# EAGLE design attiny_project (EAGLE 6.6.0)
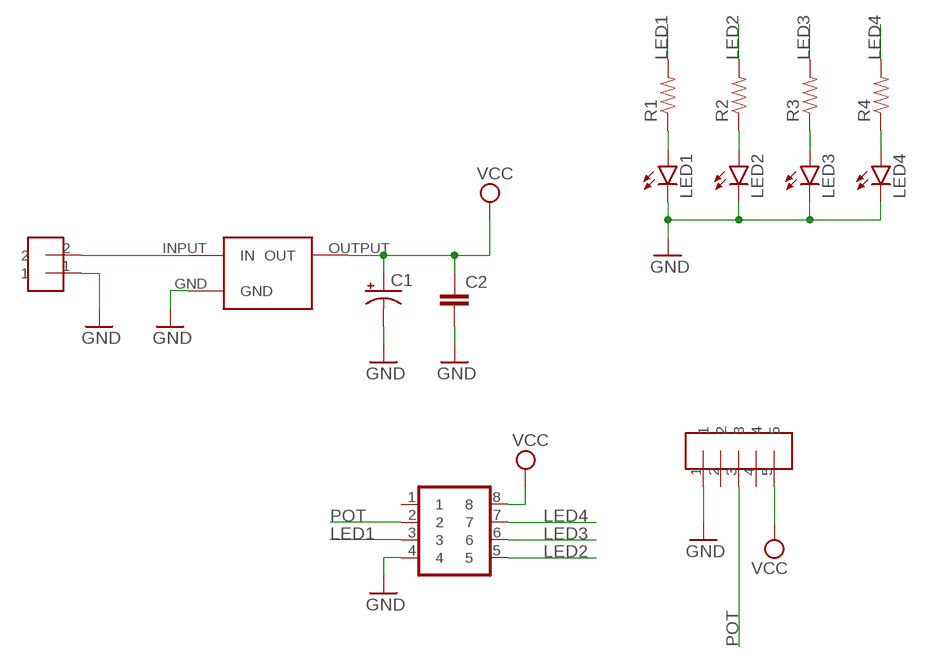
[diagram p0: schematic, sheet 1]

## Parts
C1  CAP_POLPTH2  [CPOL-RADIAL-10UF-25V]
C2  CAPPTH  [CAP-PTH-SMALL]
LED1  LED5MM  [LED5MM]
LED2  LED5MM  [LED5MM]
LED3  LED5MM  [LED5MM]
LED4  LED5MM  [LED5MM]
R1  RESISTORPTH-1/4W  [AXIAL-0.4]
R2  RESISTORPTH-1/4W  [AXIAL-0.4]
R3  RESISTORPTH-1/4W  [AXIAL-0.4]
R4  RESISTORPTH-1/4W  [AXIAL-0.4]
U$1  SOCKET-8PINDIP  [SOCKET-8PIN]
U$2  HEADER-5  [HEADER-5]
U$3  REGULATOR5V-MC7805CT  [REGULATOR-7805]
U$4  HEADER-2  [HEADER-2]

## Nets
GND: C1.2(-) C2.2 LED1.K(C) LED2.K(C) LED3.K(C) LED4.K(C) U$1.4 U$2.1 U$3.GND U$4.1
LED1: R1.P$2 U$1.3
LED2: R2.P$2 U$1.5
LED3: R3.P$2 U$1.6
LED4: R4.P$2 U$1.7
N$1: U$3.INPUT(IN) U$4.2
N$2: LED1.A R1.P$1
N$3: LED2.A R2.P$1
N$4: LED3.A R3.P$1
N$5: LED4.A R4.P$1
POT: U$1.2 U$2.3
VCC: C1.1(+) C2.1 U$1.8 U$2.5 U$3.OUTPUT(OUT)
Unconnected: U$1.1 U$2.2 U$2.4

## Library data of the parts
C1 = homemade-hardware:CAP_POL: Capacitor Polarized These are standard SMD and PTH capacitors. Normally 10uF, 47uF, and 100uF in electrolytic and tantalum varieties. Always verify the external diameter of the through hole cap, it varies with capacity, voltage, and manufacturer. The EIA devices should be standard.
C2 = homemade-hardware:CAP: Capacitor Standard 0603 ceramic capacitor, and 0.1" leaded capacitor.
LED1-LED4 = homemade-hardware:LED: LEDs Standard schematic elements and footprints for 5mm, 3mm, 1206, and 0603 sized LEDs. 5mm - Spark Fun Electronics SKU : COM-00529 (and others)
R1-R4 = homemade-hardware:RESISTOR: Resistor Basic schematic elements and footprints for 0603, 1206, and PTH resistors.
U$1 = homemade-hardware:SOCKET-8PIN
U$2 = homemade-hardware:HEADER-5
U$3 = homemade-hardware:REGULATOR
U$4 = homemade-hardware:HEADER-2

## Board
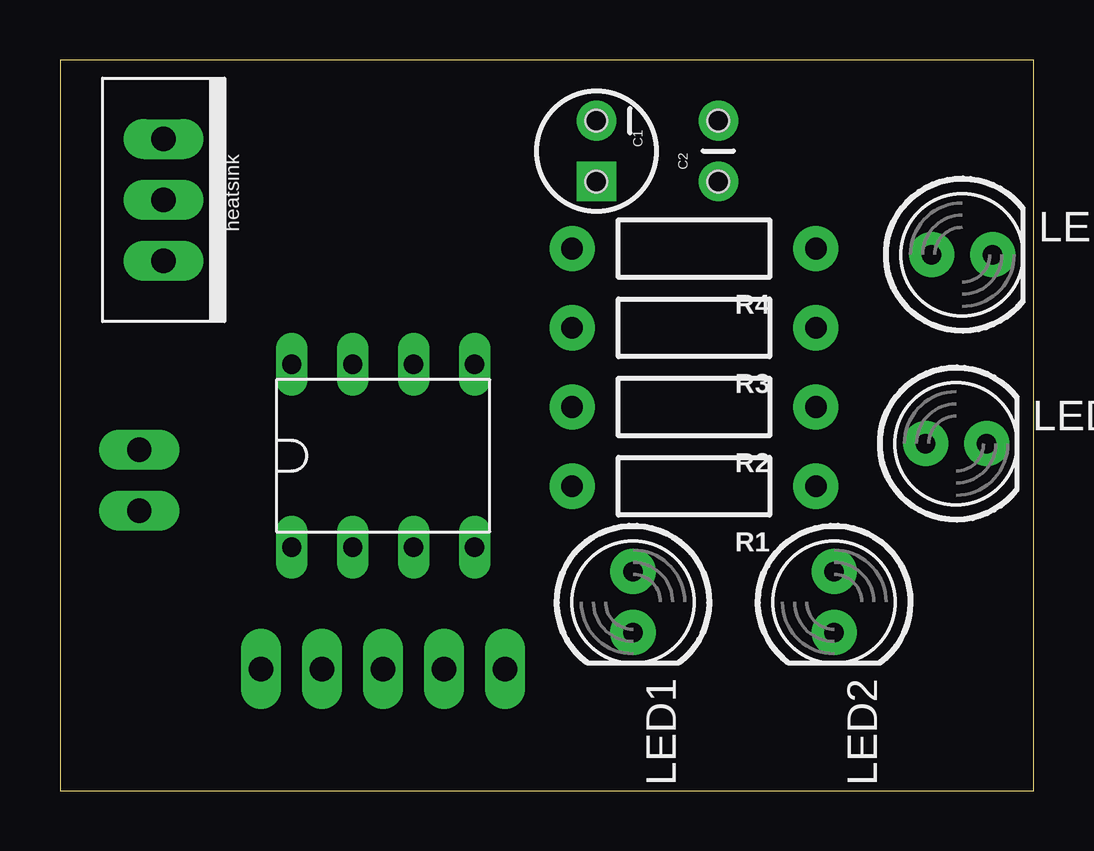
[diagram p1: board, top side]
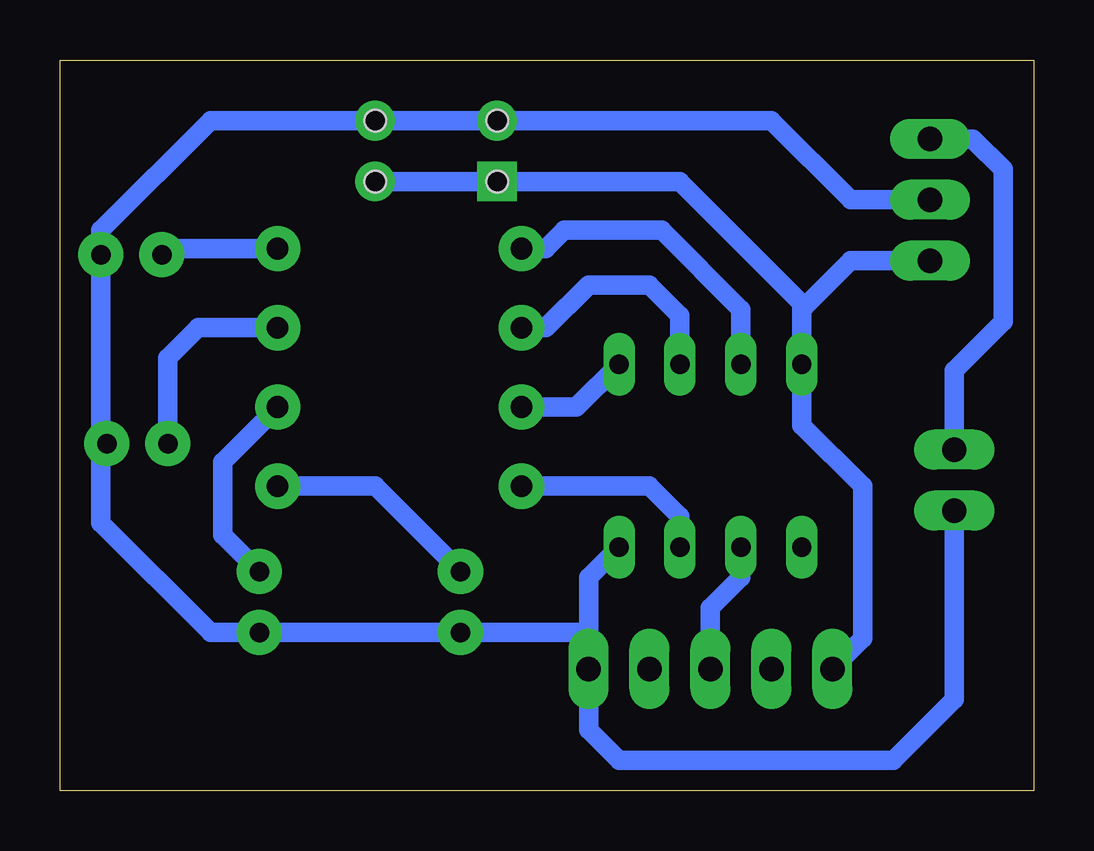
[diagram p2: board, bottom side, seen from below]

Size 40.56 x 30.47 mm. Coordinates in mm from the lower left corner, seen from the top.
Outline: 0,0 40.56,0 40.56,30.47 0,30.47 0,0
Copper layers (1*16): Top 0.035mm / dielectric 1.5mm / Bottom 0.035mm
Design rules "default": minimum track width 10mil, minimum drill 24mil, track to track 8mil, track to pad 8mil, pad to pad 8mil, via to via 8mil, smd to smd 8mil, copper to edge 40mil, drill to drill 8mil, minimum pad ring 10mil, minimum via ring 8mil, stop-mask expansion 4mil, vias tented up to drill 0mil, thermal gap 10mil
Holes 0.9 mm at 22.35,27.94 22.35,25.4 27.43,25.4 27.43,27.94

### Footprints (pad centres in the part's own frame; a part is rotated, then mirrored left to right if it is on the bottom)
CPOL-RADIAL-10UF-25V = drill 0.7 pad 1.651 square: 1 1.27,0 | drill 0.7 pad 1.651: 2 -1.27,0
CAP-PTH-SMALL = drill 0.7 pad 1.651: 1 0,0; 2 2.54,0
LED5MM = drill 0.813 pad 1.88: A -1.27,0; K 1.27,0
AXIAL-0.4 = drill 0.9 pad 1.88: P$1 -5.08,0; P$2 5.08,0
SOCKET-8PIN = drill 0.8 long: 1 -3.81,3.81; 2 -3.81,1.27; 3 -3.81,-1.27; 4 -3.81,-3.81; 5 3.81,-3.81; 6 3.81,-1.27; 7 3.81,1.27; 8 3.81,3.81
HEADER-5 = drill 1.016 pad 1.676 long: 1 0,0; 2 0,2.54; 3 0,5.08; 4 0,7.62; 5 0,10.16
REGULATOR-7805 = drill 1.016 pad 1.676 long: GND 0,2.54; INPUT 0,5.08; OUTPUT 0,0
HEADER-2 = drill 1.016 pad 1.676 long: 1 0,0; 2 0,2.54

### Placement (x,y rotation side)
C1  22.35,26.67 270 top
C2  27.43,25.4 90 top
LED1  23.88,7.87 270 top
LED2  32.26,7.87 270 top
LED3  37.34,14.48 0 top
LED4  37.59,22.35 0 top
R1  26.42,12.7 180 top
R2  26.42,16 180 top
R3  26.42,19.3 180 top
R4  26.42,22.61 180 top
U$1  13.46,13.97 90 top
U$2  18.54,5.08 90 top
U$3  4.32,22.1 0 top
U$4  3.3,11.68 0 top

### Tracks (layer width: path | path; a pad name or v marks a point on that pad's centre or on a via)
GND
  Bottom 0.813: 18.54,6.6 U$2.1 18.54,2.54 17.27,1.27 5.84,1.27 3.3,3.81 U$4.1 | 18.54,6.6 18.54,8.89 U$1.4 | 18.54,6.6 LED1.K LED2.K 34.29,6.6 38.86,11.18 38.86,14.22 LED3.K 38.86,14.73 LED4.K 38.86,23.37 34.29,27.94 C2.2 C1.2 10.92,27.94 7.62,24.64 U$3.GND
LED1
  Bottom 0.813: R1.P$2 16,12.7 14.73,11.43 U$1.3
LED2
  Bottom 0.813: R2.P$2 19.05,16 U$1.5
LED3
  Bottom 0.813: R3.P$2 20.32,19.3 18.54,21.08 16,21.08 14.73,19.81 U$1.6
LED4
  Bottom 0.813: R4.P$2 20.32,22.61 19.56,23.37 15.49,23.37 12.19,20.07 U$1.7
N$1
  Bottom 0.813: U$4.2 3.3,17.53 1.27,19.56 1.27,25.91 2.54,27.18 U$3.INPUT
N$2
  Bottom 0.813: R1.P$1 27.43,12.7 LED1.A
N$3
  Bottom 0.813: R2.P$1 33.78,13.72 33.78,10.67 LED2.A
N$4
  Bottom 0.813: R3.P$1 34.8,19.3 36.07,18.03 LED3.A
N$5
  Bottom 0.813: R4.P$1 36.07,22.61 LED4.A
POT
  Bottom 0.813: U$1.2 12.19,8.89 13.46,7.62 U$2.3
VCC
  Bottom 0.813: C2.1 C1.1 14.73,25.4 9.53,20.19 | U$2.5 7.11,6.35 7.11,12.7 9.65,15.24 U$1.8 9.65,20.07 9.53,20.19 | U$3.OUTPUT 7.62,22.1 9.53,20.19